# Altium schematic sheet sources.SchDoc: sources
size A3; Author: Martín Ramírez Espinosa; Revision: 1.0; SheetNumber: 3; SheetTotal: 3
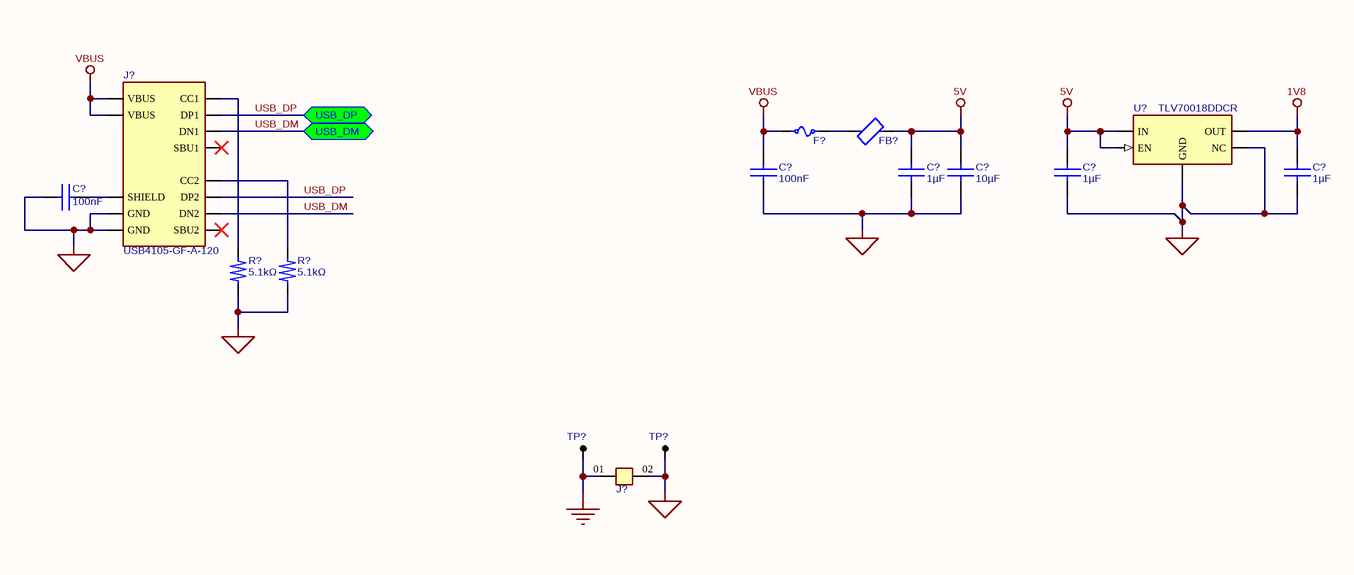
[diagram p0: sources.SchDoc]

## Parts
(Parts that share a designator on the sheet are numbered #1, #2 ... from top to bottom, then left to right.)
C?#1  value 1µF  [CAPC2012]  (hidden comment: CL21B105KBFNNNE)
C?#2  value 10µF  [CAPC3216]  (hidden comment: C3216X5R1C106K160AA)
C?#3  value 100nF  [CAPC2012]  (hidden comment: CC0805KRX7R9BB104)
C?#4  value 1µF  [CAPC2012X135N]  (hidden comment: CL21B105KBFNNNE)
C?#5  value 1µF  [CAPC2012X135N]  (hidden comment: CL21B105KBFNNNE)
C?#6  value 100nF  [CAPC2012]  (hidden comment: CC0805KRX7R9BB104)
F?  0467002.NR  [FUSC1608X31N]  (value not drawn)
FB?  BLM21PG221SN1D  [FP-BLM21-0_2-t0_85-e0_5-MFG]  (value not drawn)
J?#1  USB4105-GF-A-120  [GCT_USB4105-GF-A-120]
J?#2  HTSW-102-07-G-S  [SAMTEC_HTSW-102-XX-X-S]  (value not drawn)
R?#1  value 5.1kΩ  [RESC1608]  (hidden comment: RC0603FR-075K1L)
R?#2  value 5.1kΩ  [RESC1608]  (hidden comment: RC0603FR-075K1L)
TP?#1  5011  [KEYSTONE_5011]  (value not drawn)
TP?#2  5011  [KEYSTONE_5011]  (value not drawn)
U?  TLV70018DDCR  [SOT95P280X110-5N]

## Ports
USB_DM (bidir, see AudioLab[2B]), USB_DP (bidir, see AudioLab[2B])

## Nets
1V8: C?#5.2 U?.5(OUT)
5V: C?#1.1 C?#2.1 C?#4.2 FB?.2 U?.1(IN) U?.3(EN)
AGND: J?#2.01 TP?#1.TP
DGND: C?#1.2 C?#2.2 C?#3.1 C?#4.1 C?#5.1 C?#6.1 J?#1.A1_B12(GND) J?#1.B1_A12(GND) J?#2.02 R?#1.1 R?#2.1 TP?#2.TP U?.2(GND) U?.4(NC)
VBUS: C?#3.2 F?.2 J?#1.A4_B9(VBUS) J?#1.B4_A9(VBUS)
USB_DM: J?#1.A7(DN1) J?#1.B7(DN2) ; port USB_DM
USB_DP: J?#1.A6(DP1) J?#1.B6(DP2) ; port USB_DP
NetC?#6_2: C?#6.2 J?#1.SH(SHIELD)
NetF?_1: F?.1 FB?.1
NetJ?#1_A5: J?#1.A5(CC1) R?#1.2
NetJ?#1_B5: J?#1.B5(CC2) R?#2.2

Not connected (* = marked no-connect by the designer): J?#1 A8(SBU1)* B8(SBU2)*

## Library data of the parts
C?#1 C?#4 C?#5 = CL21B105KBFNNNE: 50V 1uF X7R ±10% 0805 Multilayer Ceramic Capacitors MLCC - SMD/SMT ROHS; Manufacturer: Samsung Electro-Mechanics; Supplier: DigiKey; Supplier Part Number: 1276-1029-1-ND; Manufacturer Part Number: CL21B105KBFNNNE; Package/Case: 0805 (2012 Metric)
C?#2 = C3216X5R1C106K160AA: Multilayer Ceramic Capacitors MLCC – SMD/SMT; TDK; C3216X5R1C106K160AA; 10 µF; 1206; 16 V; 16 V; Supplier: DigiKey; Supplier Part Number: 445-4052-1-ND; Manufacturer: TDK; Manufacturer Part Number: C3216X5R1C106K160AA; Package/Case: 1206 (3216 Metric)
C?#3 C?#6 = CC0805KRX7R9BB104: 50V 100nF X7R ±10% 0805 Multilayer Ceramic Capacitors MLCC - SMD/SMT ROHS; Manufacturer: YAGEO; Supplier: DigiKey; Supplier Part Number: 311-1140-1-ND; Manufacturer Part Number: CC0805KRX7R9BB104; Package/Case: 0805 (2012 Metric)
F? = 0467002.NR: Electric Fuse, Very Fast Blow, 2A, 32VAC, 32VDC, 35A (IR), Surface Mount, 0603; Manufacturer: Littelfuse Inc; Supplier: DigiKey; Supplier Part Number: F1397CT-ND; Manufacturer Part Number: 0467002.NR; Package/Case: 0603 (1608 Metric); Value: *
FB? = BLM21PG221SN1D: 220 Ohms @ 100 MHz 1 Power Line Ferrite Bead 0805 (2012 Metric) 2A 45mOhm
J?#1 = USB4105-GF-A-120: USB Connector, 24 Contact(s), Female, Right Angle, Solder Terminal, Locking, Receptacle
J?#2 = HTSW-102-07-G-S: Pin Header, Vertical, Board-to-Board, 2.54 mm, 1 Rows, 2 Contacts, Through Hole, HTSW
R?#1 R?#2 = RC0603FR-075K1L: Res Thick Film 0603 5.1K Ohm 1% 0.1W(1/10W) ±100ppm/C Pad SMD T/R; Manufacturer: YAGEO; Supplier: DigiKey; Supplier Part Number: 311-5.10KHRCT-ND; Manufacturer Part Number: RC0603FR-075K1L; Package/Case: 0603 (1608 Metric)
TP?#1 TP?#2 = 5011: Test Point MultiPurpose THM H .445 Nylon 46 Insulated Blk PhosBronze/Silver | Keystone Electronics 5011
U? = TLV70018DDCR: 200-mA, high-PSRR, low-IQ, low-dropout voltage regulator with enable 5-SOT-23-THIN -40 to 125